# Altium schematic sheet ETH-input.SchDoc: AA Design Challenge (part 1 of 3)
size 431 x 279 mm; Revision: 1.0; SheetNumber: 2; SheetTotal: 4; ProjectName: TRK_GPRS_GNSS_BTLE
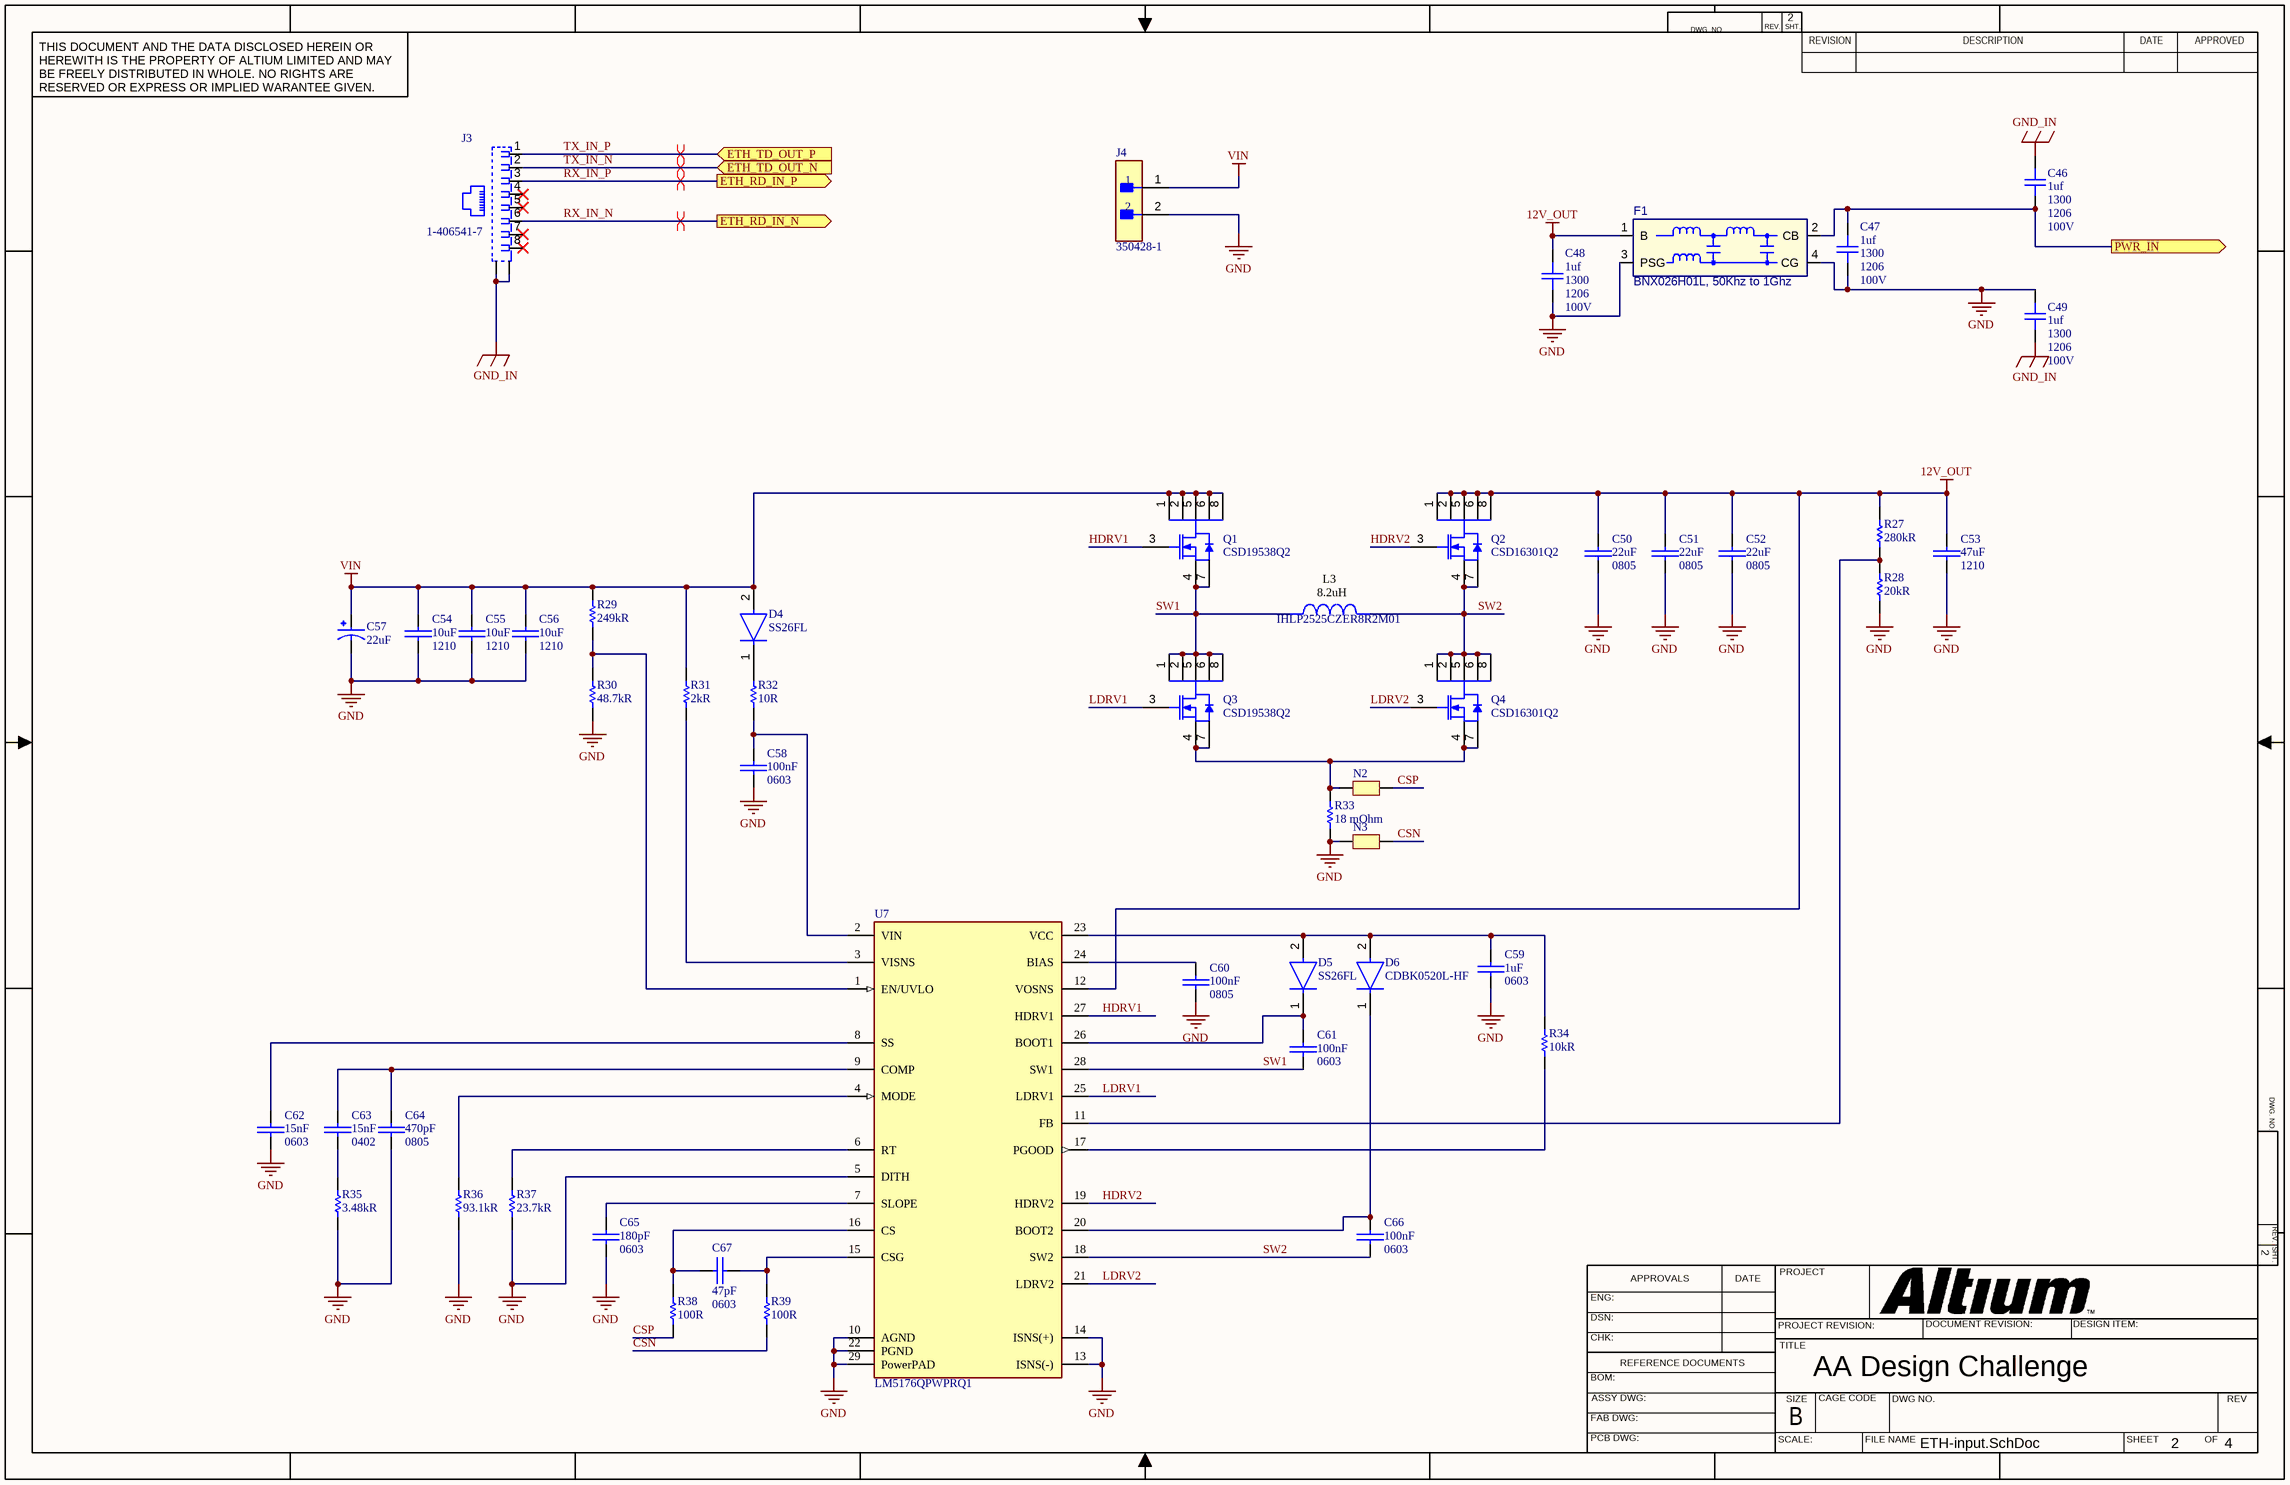
[diagram p0: ETH-input.SchDoc]

## Parts
C46  value 1uf  Case-EIA: 1206  Rated Voltage: 100V  [CAPC3216_IS1206N_3D]  (hidden comment: Capacitor - 1uf 100V 10% X7R 01206)
C47  value 1uf  Case-EIA: 1206  Rated Voltage: 100V  [CAPC3216_IS1206N_3D]  (hidden comment: Capacitor - 1uf 100V 10% X7R 01206)
C48  value 1uf  Case-EIA: 1206  Rated Voltage: 100V  [CAPC3216_IS1206N_3D]  (hidden comment: Capacitor - 1uf 100V 10% X7R 01206)
C49  value 1uf  Case-EIA: 1206  Rated Voltage: 100V  [CAPC3216_IS1206N_3D]  (hidden comment: Capacitor - 1uf 100V 10% X7R 01206)
C50  22uF  Case/Package: 0805  [CAPC2012X145USR]
C51  22uF  Case/Package: 0805  [CAPC2012X145USR]
C52  22uF  Case/Package: 0805  [CAPC2012X145USR]
C53  47uF  Case/Package: 1210  [C1210]
C54  10uF  Case/Package: 1210  [C1210]
C55  10uF  Case/Package: 1210  [C1210]
C56  10uF  Case/Package: 1210  [C1210]
C57  22uF  [CAP_EEEHC1H220XP]
C58  100nF  Case/Package: 0603  [CAP_0603]
C59  1uF  Case/Package: 0603  [CAP_0603]
C60  100nF  Case/Package: 0805  [CAPC2012X145USR]
C61  100nF  Case/Package: 0603  [CAP_0603]
C62  15nF  Case/Package: 0603  [CAP_0603]
C63  15nF  Case/Package: 0402  [CAPC1005X55USR]
C64  470pF  Case/Package: 0805  [CAPC2012X145USR]
C65  180pF  Case/Package: 0603  [CAP_0603]
C66  100nF  Case/Package: 0603  [CAP_0603]
C67  47pF  Case/Package: 0603  [CAP_0603]
D4  SS26FL  [SOD-123F]
D5  SS26FL  [SOD-123F]
D6  CDBK0520L-HF  [SOD-123F _CDBK]
F1  value BNX026H01L, 50Khz to 1Ghz  [1359]  (hidden comment: BNX026)
J3  1-406541-7  [TE_1-406507-5]
J4  350428-1  [FP-350428-1-MFG]
L3  8.2uH  Manufacturer Part Number: IHLP2525CZER8R2M01  [INDM686X647X300N]
N2  NT  [Net Tie 10mil]  (value not drawn)  (net tie, no BOM)
N3  NT  [Net Tie 10mil]  (value not drawn)  (net tie, no BOM)
Q1  CSD19538Q2  [TRANS_6WSON_2X2]
Q2  CSD16301Q2  [TRANS_6WSON_2X2]
Q3  CSD19538Q2  [TRANS_6WSON_2X2]
Q4  CSD16301Q2  [TRANS_6WSON_2X2]
R27  280kR  [R0603]
R28  20kR  [R0603]
R29  249kR  [RESC0603X26N]
R30  48.7kR  [RESC1005X40USR]
R31  2kR  [R0603]
R32  10R  [R0603]
R33  18 mOhm  [RES 1206N - 71]
R34  10kR  [R0603]
R35  3.48kR  [RESC1005X40USR]
R36  93.1kR  [R0603]
R37  23.7kR  [RESC0603X26N]
R38  100R  [R0603]
R39  100R  [R0603]
U7  LM5176QPWPRQ1  [IC_LM5176QPWPRQ1]

## Ports
ETH_RD_IN_N (out), ETH_RD_IN_P (out), ETH_TD_OUT_N (in), ETH_TD_OUT_P (in), PWR_IN (out)

## Nets
12V_OUT: C48.1 C50.1 C51.1 C52.1 C53.1 F1.1(B) Q2.1(DRAIN) Q2.2(DRAIN) Q2.5(DRAIN) Q2.6(DRAIN) Q2.8(DRAIN) R27.2 U7.12(VOSNS)
GND: C47.2 C48.2 C49.2 C50.2 C51.2 C52.2 C53.2 C54.2 C55.2 C56.2 C57.2 C58.2 C59.2 C60.2 C62.2 C64.2 C65.2 F1.3(PSG) F1.4(CG) J4.2 N3.1 R28.1 R30.1 R33.1 R35.1 R36.1 R37.1 U7.5(DITH) U7.10(AGND) U7.13(ISNS(-)) U7.14(ISNS(+)) U7.22(PGND) U7.29(PowerPAD)
GND_IN: C46.1 C49.1 J3.9(S1) J3.10(S2)
VIN: C54.1 C55.1 C56.1 C57.1 D4.2(A) J4.1 Q1.1(DRAIN) Q1.2(DRAIN) Q1.5(DRAIN) Q1.6(DRAIN) Q1.8(DRAIN) R29.2 R31.2
CSN: N3.2 R39.1
CSP: N2.2 R38.1
HDRV1: Q1.3(GATE) U7.27(HDRV1)
HDRV2: Q2.3(GATE) U7.19(HDRV2)
LDRV1: Q3.3(GATE) U7.25(LDRV1)
LDRV2: Q4.3(GATE) U7.21(LDRV2)
PWR_IN: C46.2 C47.1 F1.2(CB) ; port PWR_IN
RX_IN_N: J3.6 ; port ETH_RD_IN_N
RX_IN_P: J3.3 ; port ETH_RD_IN_P
SW1: C61.2 L3.1 Q1.4(SOURCE) Q1.7(SOURCE) Q3.1(DRAIN) Q3.2(DRAIN) Q3.5(DRAIN) Q3.6(DRAIN) Q3.8(DRAIN) U7.28(SW1)
SW2: C66.2 L3.2 Q2.4(SOURCE) Q2.7(SOURCE) Q4.1(DRAIN) Q4.2(DRAIN) Q4.5(DRAIN) Q4.6(DRAIN) Q4.8(DRAIN) U7.18(SW2)
TX_IN_N: J3.2 ; port ETH_TD_OUT_N
TX_IN_P: J3.1 ; port ETH_TD_OUT_P
NetC58_1: C58.1 R32.1 U7.2(VIN)
NetC59_1: C59.1 D5.2(A) D6.2(A) R34.2 U7.23(VCC)
NetC60_1: C60.1 U7.24(BIAS)
NetC61_1: C61.1 D5.1(C) U7.26(BOOT1)
NetC62_1: C62.1 U7.8(SS)
NetC63_1: C63.1 C64.1 U7.9(COMP)
NetC63_2: C63.2 R35.2
NetC65_1: C65.1 U7.7(SLOPE)
NetC66_1: C66.1 D6.1(C) U7.20(BOOT2)
NetC67_1: C67.1 R38.2 U7.16(CS)
NetC67_2: C67.2 R39.2 U7.15(CSG)
NetD4_1: D4.1(C) R32.2
NetN2_1: N2.1 Q3.4(SOURCE) Q3.7(SOURCE) Q4.4(SOURCE) Q4.7(SOURCE) R33.2
NetR27_1: R27.1 R28.2 U7.11(FB)
NetR29_1: R29.1 R30.2 U7.1(EN/UVLO)
NetR31_1: R31.1 U7.3(VISNS)
NetR34_1: R34.1 U7.17(PGOOD)
NetR36_2: R36.2 U7.4(MODE)
NetR37_2: R37.2 U7.6(RT)

Not connected (* = marked no-connect by the designer): J3 4* 5* 7* 8*

## Layout directives
differential pair: RX_IN_N, RX_IN_P, TX_IN_N, TX_IN_P

## Notes on the sheet
- DWG. NO.
- REV.
- SHT.
- THIS DOCUMENT AND THE DATA DISCLOSED HEREIN OR HEREWITH IS THE PROPERTY OF ALTIUM LIMITED AND MAY BE FREELY DISTRIBUTED IN WHOLE. NO RIGHTS ARE RESERVED OR EXPRESS OR IMPLIED WARANTEE GIVEN.
- REVISION
- DESCRIPTION
- DATE
- APPROVED
- ENG:
- APPROVALS
- PROJECT
- DSN:
- CHK:
- REFERENCE DOCUMENTS
- PROJECT REVISION:
- TITLE
- DOCUMENT REVISION:
- DESIGN ITEM:
- BOM:
- FAB DWG:
- PCB DWG:
- ASSY DWG:
- SCALE:
- SIZE
- B
- CAGE CODE
- FILE NAME
- DWG NO.
- SHEET
- OF
- REV